# EAGLE design AtTiny Board.schV3 (EAGLE 9.2.2)
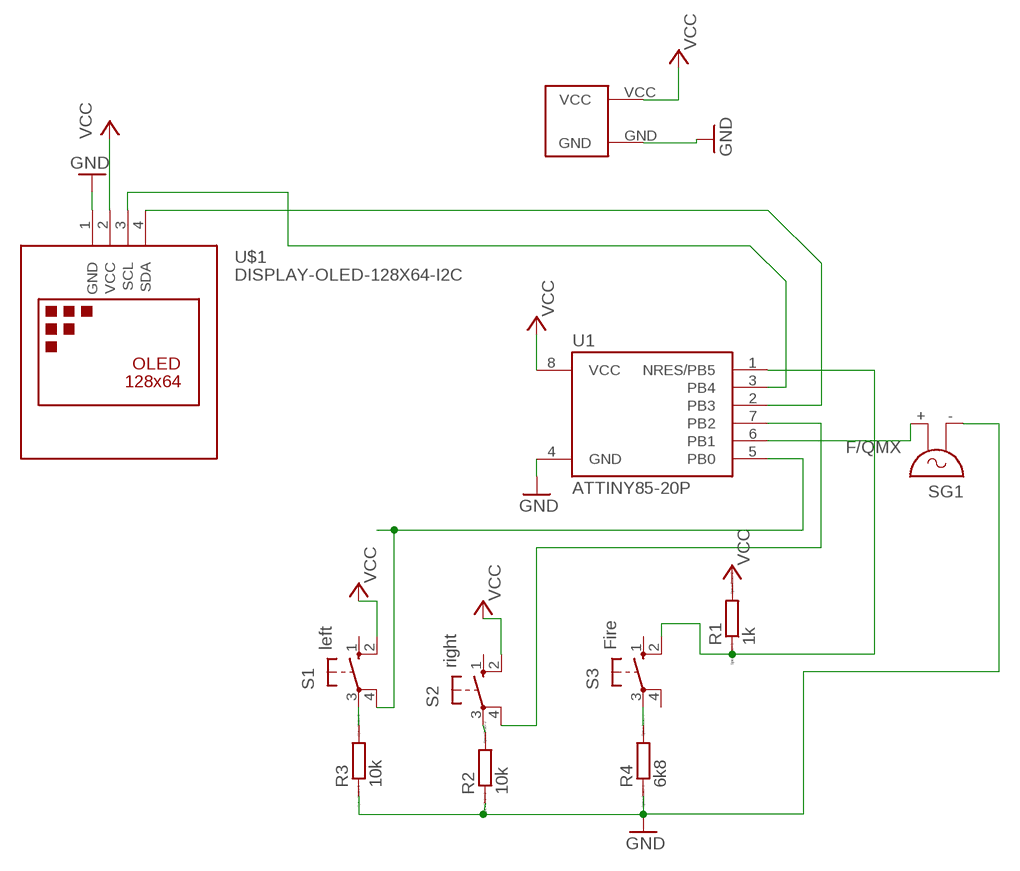
[diagram p0: schematic, sheet 1]

## Parts
R1  1k  R0204/7  [0204/7]
R2  10k  R0204/7  [0204/7]
R3  10k  R0204/7  [0204/7]
R4  6k8  R0204/7  [0204/7]
S1  left  10-XX  [B3F-10XX]
S2  right  10-XX  [B3F-10XX]
S3  Fire  10-XX  [B3F-10XX]
SG1  F/QMX  [F/QMX]
U1  ATTINY85-20P  [PDIP08_300MIL]
U$1  DISPLAY-OLED-128X64-I2C  [DISPLAY-OLED-128X64-I2C]
U$3  CR2032_19MMDB  [CR2032-19MM]

## Nets
GND: R2.1 R3.1 R4.1 SG1.- U1.4(GND) U$1.1(GND) U$3.GND
N$3: SG1.+ U1.6(PB1)
PB0LEFT: S1.4(P1) U1.5(PB0)
PB2RIGHT: S2.4(P1) U1.7(PB2)
PB5FIRE: R1.1 S3.2(S1) U1.1(NRES/PB5)
R2TOGND: R2.2 S2.3(P)
R3TGND: R3.2 S1.3(P)
R4TOGND: R4.2 S3.3(P)
SCL: U1.3(PB4) U$1.3(SCL)
SDA: U1.2(PB3) U$1.4(SDA)
VCC: R1.2 S1.2(S1) S2.2(S1) U1.8(VCC) U$1.2(VCC) U$3.VCC
Unconnected: S1.1(S) S2.1(S) S3.1(S) S3.4(P1)

## Library data of the parts
R1-R4 = eagle-ltspice:R: RESISTOR, European symbol; SPICEMODEL: NONE; SPICEPREFIX: R
S1-S3 = switch-omron:10-XX: OMRON SWITCH; MPN: B3F-1000; OC_FARNELL: 176432; OC_NEWARK: 36M3542
SG1 = buzzer:F/QMX: BUZZER Source: Buerklin; OC_FARNELL: unknown; OC_NEWARK: unknown
U1 = _hhn_attiny25_45_85:ATTINY85*: ATMEL ATtiny 85 Packages: P = PDIP 08 30mil S = SOIC 08 EIAJ 208mil Technologies Note: for complete ordering code (temp. range, finish, tape&reel etc.) see www.atmel.com • Supply Voltage: V = (1.8…5.5)V | [blank] = (2.7…5.5)V • Speed: 10 = 10 MHz | 20 = 20 MHz Author: Dipl.-Ing. FH Rainer Bayer HHN Hochschule Heilbronn (Heilbronn University), rainer.bayer@hs-heilbronn.de Ingenieurbüro ing-rb, mail@ing-rb.de
U$1 = diy-modules:DISPLAY-OLED-128X64-I2C: 128x64 Dot Matrix OLED Module based on SSD1306 chip Variant with I2C interface More details available here: http://www.instructables.com/id/Monochrome-096-i2c-OLED-display-with-arduino-SSD13/ SSD1306 datasheet: https://cdn-shop.adafruit.com/datasheets/SSD1306.pdf Click here to find device on ebay.com <http://www.ebay.com/sch/oled+display+128x64+iic> Note: There are two variants: I2C and SPI. Search for the proper version.
U$3 = CR2032DB19:CR2032_19MMDB

## Board
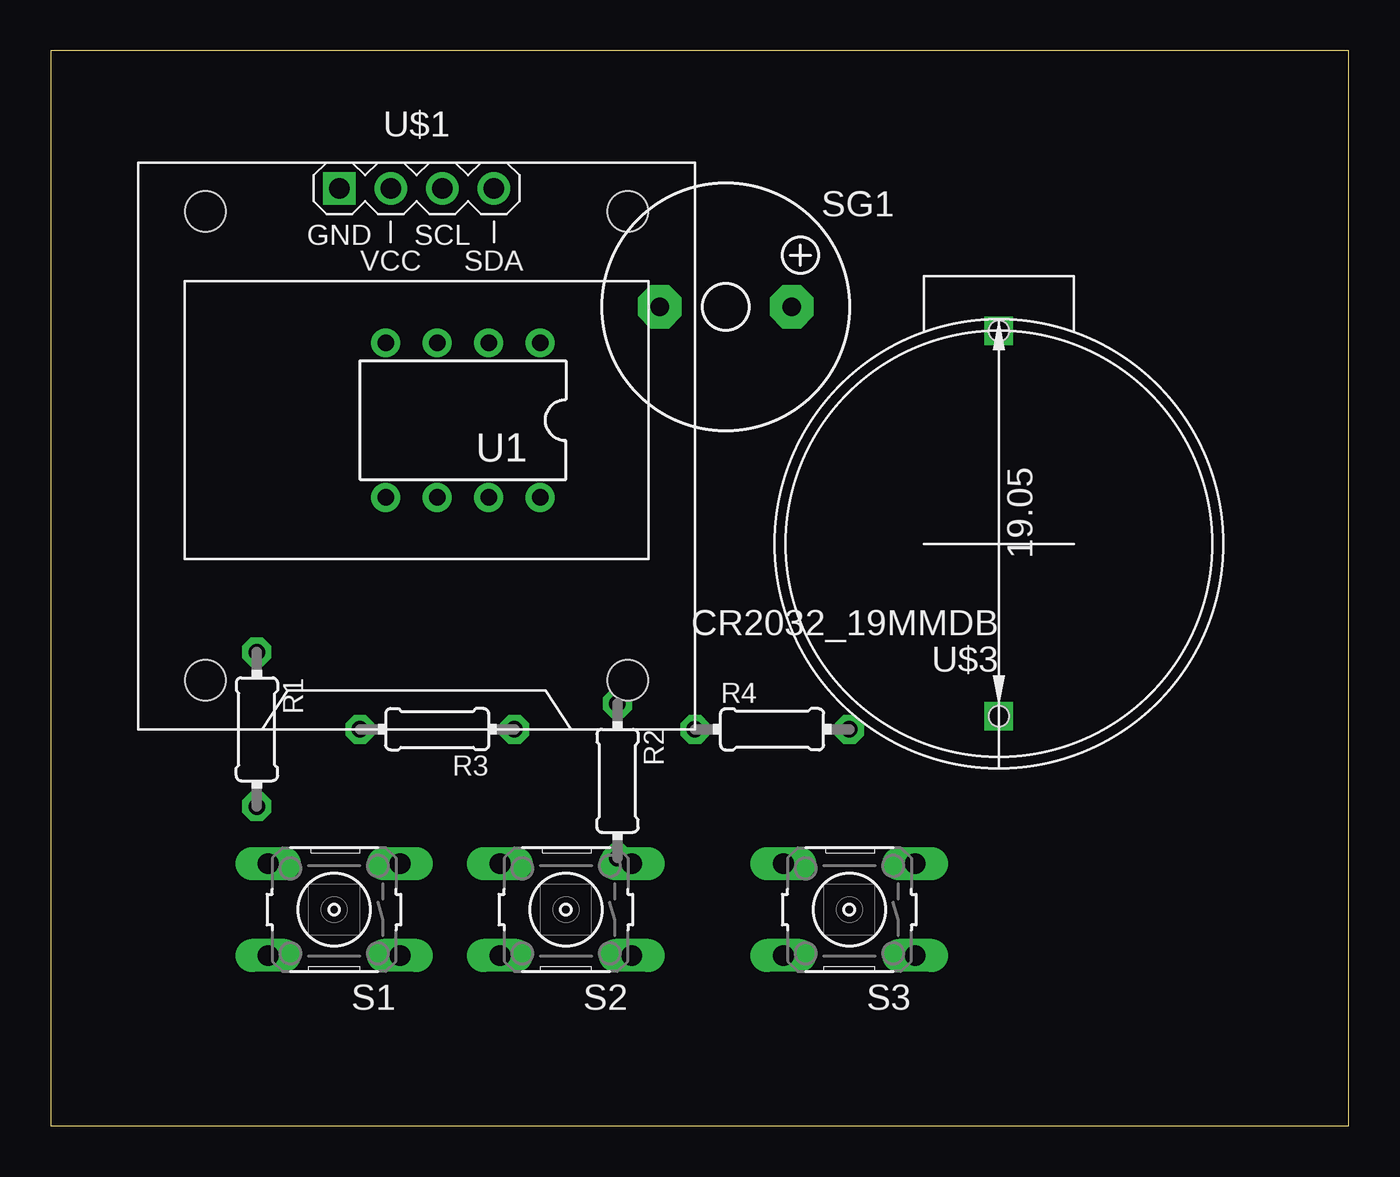
[diagram p1: board, top side]
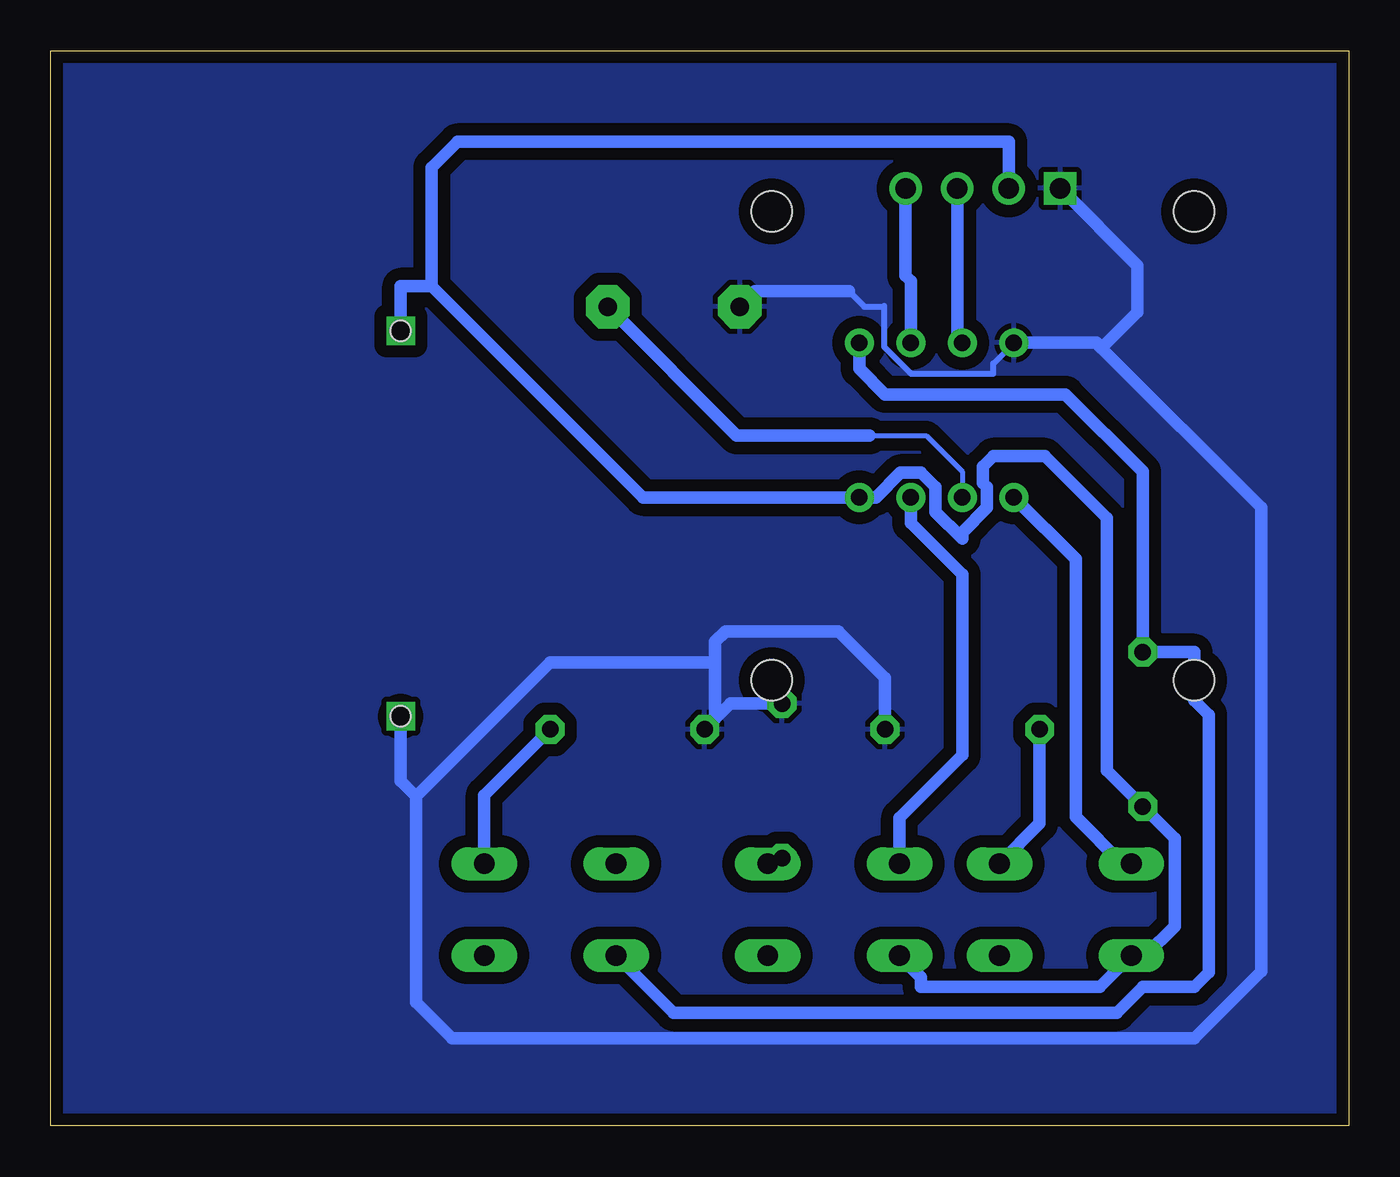
[diagram p2: board, bottom side, seen from below]

Size 63.99 x 53.01 mm. Coordinates in mm from the lower left corner, seen from the top.
Outline: 0,0 63.99,0 63.99,53.01 0,53.01 0,0
Copper layers (1*16): Top 0.035mm / dielectric 1.5mm / Bottom 0.035mm
Design rules "SparkFun": minimum track width 8mil, minimum drill 20mil, track to track 8mil, track to pad 8mil, pad to pad 8mil, via to via 8mil, smd to smd 8mil, copper to edge 10mil, drill to drill 8mil, minimum pad ring 12mil, minimum via ring 10mil, stop-mask expansion 4mil, vias tented up to drill 25mil, thermal gap 10mil

### Footprints (pad centres in the part's own frame; a part is rotated, then mirrored left to right if it is on the bottom)
0204/7 = drill 0.813 octagon: 1 -3.81,0; 2 3.81,0
B3F-10XX = drill 1.016 long: 1 -3.251,2.261; 2 3.251,2.261; 3 -3.251,-2.261; 4 3.251,-2.261
F/QMX = drill 0.914 pad 2.159 octagon: + 3.251,0; - -3.251,0
PDIP08_300MIL = drill 0.813: 1 -3.81,-3.81; 2 -1.27,-3.81; 3 1.27,-3.81; 4 3.81,-3.81; 5 3.81,3.81; 6 1.27,3.81; 7 -1.27,3.81; 8 -3.81,3.81
DISPLAY-OLED-128X64-I2C = drill 1 square: 1 -3.81,12.7 | drill 1: 2 -1.27,12.7; 3 1.27,12.7; 4 3.81,12.7 | hole 2: -10.414,11.557; 10.414,11.557; 10.414,-11.557; -10.414,-11.557
CR2032-19MM = drill 0.8 square: GND 0,8.5; VCC 0,-10.5 | hole 1: 0,8.5; 0,-10.5

### Placement (x,y rotation side)
R1  10.16,19.56 270 top
R2  27.94,17.02 270 top
R3  19.05,19.56 180 top
R4  35.56,19.56 0 top
S1  13.97,10.67 180 top
S2  25.4,10.67 180 top
S3  39.37,10.67 180 top
SG1  33.27,40.39 0 top
U1  20.32,34.8 180 top
U$1  18.03,33.53 0 top
U$3  46.74,28.7 180 top

### Tracks (layer width: path | path; a pad name or v marks a point on that pad's centre or on a via)
GND
  Bottom 0.305: 22.91,40.44 22.91,40.39 | 22.91,40.39 22.91,38.42 21.57,37.08 17.53,37.08 17.53,37.59 U1.4 | 24.64,41.15 23.88,40.39 22.91,40.39
  Bottom 0.61: R3.1 22.86,22.1 25.15,24.38 30.73,24.38 31.24,23.88 31.24,22.86 | 31.24,22.86 31.24,20.07 R4.1 30.48,20.83 R2.1 | 31.24,22.86 39.37,22.86 45.97,16.26 | 45.97,16.26 45.97,6.1 44.2,4.32 7.62,4.32 4.32,7.62 4.32,30.48 12.19,38.35 | U1.4 12.45,38.61 12.19,38.35 | SG1.- 29.26,41.15 24.64,41.15 | 12.19,38.35 10.41,40.13 10.41,42.42 U$1.1 | U$3.GND 46.74,17.02 45.97,16.26
  pour Bottom (isolate 0.61): 0.25,0 0.25,52.83 63.75,52.83 63.75,0
N$3
  Bottom 0.254: 23.62,34.04 20.83,34.04 19.05,32.26 U1.6
  Bottom 0.61: SG1.+ 30.17,34.04 23.62,34.04
PB0LEFT
  Bottom 0.61: S1.4 11.15,12.93 13.46,15.24 13.46,27.94 U1.5
PB2RIGHT
  Bottom 0.61: S2.4 22.15,15.19 19.05,18.29 19.05,27.18 21.59,29.72 U1.7
PB5FIRE
  Bottom 0.61: S3.2 33.3,5.59 11.43,5.59 10.16,6.86 7.62,6.86 6.91,7.57 6.91,20.27 7.62,20.98 7.62,23.37 R1.1 10.16,32.26 13.97,36.07 22.86,36.07 24.13,37.34 U1.1
R2TOGND
  Bottom 0.61: R2.2 28.22,12.93 S2.3
R3TGND
  Bottom 0.61: S1.3 15.24,14.91 R3.2
R4TOGND
  Bottom 0.61: S3.3 42.62,16.31 R4.2
SCL
  Bottom 0.61: U$1.3 19.3,38.86 U1.3
SDA
  Bottom 0.61: U$1.4 21.84,41.91 21.59,41.66 U1.2
VCC
  Bottom 0.61: 45.21,41.4 34.8,30.99 U1.8 23.31,30.99 22.09,32.21 21.09,32.21 20.37,31.49 20.37,30.28 19.05,28.96 19.05,29.26 17.83,30.48 17.83,31.49 18.03,31.7 18.03,32.51 17.53,33.02 14.99,33.02 11.94,29.97 11.94,17.53 R1.2 8.58,14.17 8.58,9.84 10.02,8.41 S1.2 12.27,6.86 21.08,6.86 21.08,7.34 S2.2 | U$1.2 16.76,48.51 43.94,48.51 45.21,47.24 45.21,41.4 | 45.21,41.4 46.74,41.4 U$3.VCC